# Altium schematic sheet Output.SchDoc
size A4
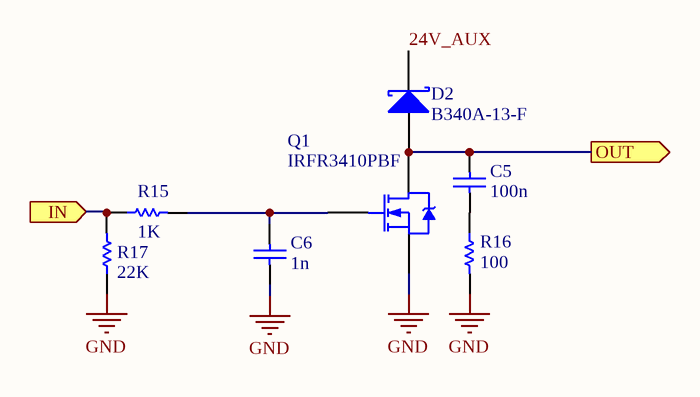
[diagram p0: Output.SchDoc]

## Parts
C5  value 100n  [SMT0805_M]  (hidden comment: X7R/0805/50V)
C6  value 1n  [SMT0805_M]  (hidden comment: X7R/0805/50V)
D2  B340A-13-F  [SMB]
Q1  IRFR3410PBF  [TO-252AA_M]
R15  value 1K  [SMT0805_M]  (hidden comment: 0805/.125W/5Q)
R16  value 100  [SMT0805_M]  (hidden comment: 0805/.125W/5Q)
R17  value 22K  [SMT0805_M]  (hidden comment: 0805/.125W/5Q)

## Ports
IN (in), OUT (out)

## Nets
GND: C6.1 Q1.3(S) R16.2 R17.1
24V_AUX: D2.2(K)
IN: R15.1 R17.2 ; port IN
OUT: C5.2 D2.1(A) Q1.4(D) ; port OUT
NetC5_1: C5.1 R16.1
NetC6_2: C6.2 Q1.1(G) R15.2

## Library data of the parts
C5 C6 = Cap: Capacitor; Published: 8-Jun-2000; LatestRevisionDate: 17-Jul-2002; LatestRevisionNote: Re-released for DXP Platform.; PackageReference: RAD-0.3; Publisher: Altium Limited; PackageDescription: Radial Cap, Thru-Hole; 2 Leads; 0.3 in Pin Spacing
D2 = D Schottky: Schottky Diode; MFT: DIODES; PN1: MBRA340T3G; MFT1: ON; PN: B340A-13-F
Q1 = IRFR1N60A: HEXFET Power MOSFET; SAP: 1664.0093.0028; MFT: INFINEON; PackageVersion: Feb-2003; ComponentLink1Description: Manufacturer Link; ComponentLink1URL: http://www.irf.com/; ComponentLink2Description: Datasheet; ComponentLink2URL: http://www.irf.com/product-info/datasheets/data/irfr1n60a.pdf; PN: IRFR3410PBF
R15-R17 = Res1: Resistor; Published: 8-Jun-2000; LatestRevisionDate: 17-Jul-2002; LatestRevisionNote: Re-released for DXP Platform.; PackageReference: AXIAL-0.3; Publisher: Altium Limited; PackageDescription: Axial Device, Thru-Hole; 2 Leads; 0.3 in Pin Spacing